# Altium schematic sheet Sensor Connection.SchDoc: Sensor Connection
size A4; DocumentNumber: 13; SheetNumber: 13; SheetTotal: 51
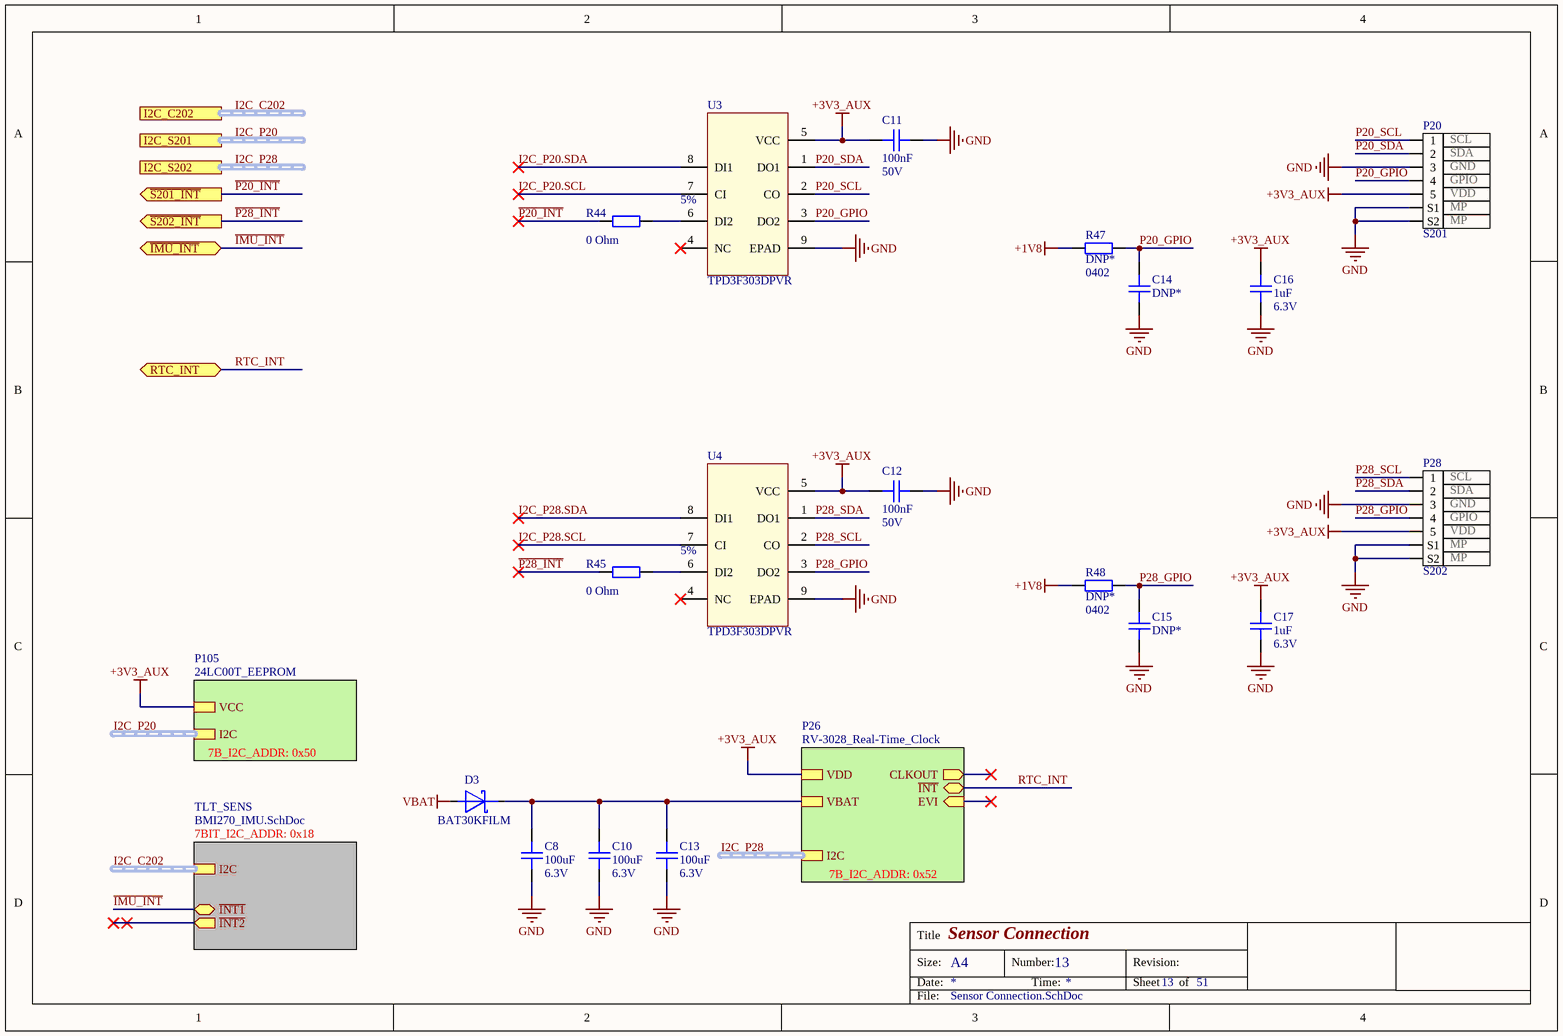
[diagram p0: Sensor Connection.SchDoc]

## Parts
C8  Capacitance: 100uF  Voltage Rating: 6.3V  [C0805]  (hidden comment: CAP CER 100UF 6.3V X5R 0805)
C10  Capacitance: 100uF  Voltage Rating: 6.3V  [C0805]  (hidden comment: CAP CER 100UF 6.3V X5R 0805)
C11  Capacitance: 100nF  Voltage: 50V  [C0402]  (hidden comment: CAP CER 0.1UF 50V X7R 0402)
C12  Capacitance: 100nF  Voltage: 50V  [C0402]  (hidden comment: CAP CER 0.1UF 50V X7R 0402)
C13  Capacitance: 100uF  Voltage Rating: 6.3V  [C0805]  (hidden comment: CAP CER 100UF 6.3V X5R 0805)
C14  DNP*  [C0402]  (no BOM)
C15  DNP*  [C0402]  (no BOM)
C16  Capacitance: 1uF  Voltage Rating: 6.3V  [C0402]  (hidden comment: CAP CER 1UF 6.3V X5R 0402)
C17  Capacitance: 1uF  Voltage Rating: 6.3V  [C0402]  (hidden comment: CAP CER 1UF 6.3V X5R 0402)
D3  BAT30KFILM  [SOD-523]
P20  S201  pin_1: SCL  pin_2: SDA  pin_3: GND  pin_4: GPIO  pin_5: VDD  pin_MP1: MP  [CONN_0545500571]
P28  S202  pin_1: SCL  pin_2: SDA  pin_3: GND  pin_4: GPIO  pin_5: VDD  pin_MP1: MP  [CONN_0545500571]
R44  Tolerance: 5%  Resistance: 0 Ohm  [R0402]  (hidden comment: RES SMD 0 OHM JUMPER 1/16W 0402)
R45  Tolerance: 5%  Resistance: 0 Ohm  [R0402]  (hidden comment: RES SMD 0 OHM JUMPER 1/16W 0402)
R47  DNP*  Case/Package: 0402  [R0402]  (no BOM)
R48  DNP*  Case/Package: 0402  [R0402]  (no BOM)
U3  TPD3F303DPVR  [DPV8_1P7X0P4]
U4  TPD3F303DPVR  [DPV8_1P7X0P4]

## Sub-sheets
P26 = RV-3028_Real-Time_Clock: I2C (harness I2C), EVI (in), CLKOUT (out), ~{INT} (bidir), VDD, VBAT  | 7B_I2C_ADDR: 0x52
P105 = 24LC00T_EEPROM: I2C (harness I2C), VCC  | 7B_I2C_ADDR: 0x50
TLT_SENS = BMI270_IMU.SchDoc: ~{INT2} (out), ~{INT1} (bidir), I2C (harness I2C)  | 7BIT_I2C_ADDR: 0x18

## Ports
I2C_C202 (harness I2C), I2C_S201 (harness I2C), I2C_S202 (harness I2C), RTC_INT (bidir), ~{IMU_INT} (bidir), ~{S201_INT} (out), ~{S202_INT} (out)

## Nets
+1V8: R47.2 R48.2
+3V3_AUX: C11.1 C12.1 C16.2 C17.2 P20.5 P28.5 U3.5(VCC) U4.5(VCC) ; sheet P105/VCC, sheet P26/VDD
GND: C8.1 C10.1 C11.2 C12.2 C13.1 C14.1 C15.1 C16.1 C17.1 P20.0(S1) P20.3 P28.0(S1) P28.3 U3.9(EPAD) U4.9(EPAD)
VBAT: D3.2(A)
~{IMU_INT}: port ~{IMU_INT}, sheet TLT_SENS/~{INT1}
~{P20_INT}: R44.1 ; port ~{S201_INT}
~{P28_INT}: R45.1 ; port ~{S202_INT}
I2C_P20.SCL: U3.7(CI)
I2C_P20.SDA: U3.8(DI1)
I2C_P28.SCL: U4.7(CI)
I2C_P28.SDA: U4.8(DI1)
P20_GPIO: C14.2 P20.4 R47.1 U3.3(DO2)
P20_SCL: P20.1 U3.2(CO)
P20_SDA: P20.2 U3.1(DO1)
P28_GPIO: C15.2 P28.4 R48.1 U4.3(DO2)
P28_SCL: P28.1 U4.2(CO)
P28_SDA: P28.2 U4.1(DO1)
RTC_INT: port RTC_INT, sheet P26/~{INT}
NetC8_2: C8.2 C10.2 C13.2 D3.1(K) ; sheet P26/VBAT
NetR44_2: R44.2 U3.6(DI2)
NetR45_2: R45.2 U4.6(DI2)

Not connected (* = marked no-connect by the designer): U3 4(NC)*; U4 4(NC)*

## Buses and harness runs
harness I2C_C202 = port I2C_C202
harness I2C_C202 = sheet TLT_SENS/I2C
harness I2C_P20 = port I2C_S201
harness I2C_P20 = sheet P105/I2C
harness I2C_P28 = port I2C_S202
harness I2C_P28 = sheet P26/I2C

## Notes on the sheet
- Title
- Size:
- Date:
- A4
- Number:
- Time:
- Revision:
- Sheet
- of
- File:

## Library data of the parts
C8 C10 C13 = CAP CER 100UF 6.3V X5R 0805: 100 µF ±20% 6.3V Ceramic Capacitor X5R 0805 (2012 Metric); Manufacturer: CAL-CHIP ELECTRONICS, INC.; Manufacturer Part Number: GMC21X5R107M6R3NT; Supplier 1: Digi-Key; Stock 1: 3990; Pricing 1: 1=0.49, 10=0.348, 50=0.2632, 100=0.2293, 500=0.1698, 1000=0.1444 (USD); Mount: Surface Mount; Case/Package: 0805; Weight: 0.000571oz; Case Code (Imperial): 0805; Case Code (Metric): 2012; Min Operating Temperature: -55°C; Max Operating Temperature: 85°C; Tolerance: 20%; Packaging: Tape and Reel; Voltage Rating (DC): 6.3V; Dielectric: X5R; Termination: SMD/SMT; Composition: Ceramic; Length: 2mm; Width: 1.25mm; Thickness: 0.071inch; Depth: 1.5mm; Radiation Hardening: No; Lead Free: Lead Free; Halogen Free: Halogen Free; ComponentLink1URL: https://www.digikey.com/en/products/detail/cal-chip-electronics-inc/GMC21X5R107M6R3NT/12140431; ComponentLink1Description: https://www.digikey.com/en/products/detail/cal-chip-electronics-inc/GMC21X5R107M6R3NT/12140431; Supplier Part Number 1: 2571-GMC21X5R107M6R3NTTR-ND
C11 C12 = CAP CER 0.1UF 50V X7R 0402: 0.1µF ±10% 50V Ceramic Capacitor X7R 0402 (1005 Metric); Manufacturer: TDK; Manufacturer Part Number: CGA2B3X7R1H104K050BB; Supplier 1: Digi-Key; Stock 1: 2925303; Pricing 1: 1=0.17, 10=0.118, 50=0.0668, 100=0.0553, 500=0.0388, 1000=0.0321, 2500=0.0299, 5000=0.0273 (USD); Mount: Surface Mount; Case/Package: 0402; Weight: 2.3E-05oz; Case Code (Metric): 1005; Case Code (Imperial): 0402; Min Operating Temperature: -55°C; Max Operating Temperature: 125°C; Voltage Rating: 50V; Tolerance: 10%; Packaging: Tape and Reel; Package Quantity: 1; Voltage Rating (DC): 50V; Dielectric: X7R; Termination: SMD/SMT; Composition: Ceramic; Length: 1mm; Height: 0.5mm; Width: 0.02inch; Thickness: 0.022inch; Depth: 0.5mm; Ratings: AEC-Q200; REACH SVHC: No SVHC; Lead Free: Lead Free; ComponentLink1URL: http://product.tdk.com/capacitor/mlcc/en/documents/mlccspec_automotive_general_midvoltage_en.pdf?src-supplier=Future+Electronics; ComponentLink1Description: http://product.tdk.com/capacitor/mlcc/en/documents/mlccspec_automotive_general_midvoltage_en.pdf?src-supplier=Future+Electronics; ComponentLink2URL: http://www.farnell.com/datasheets/1807242.pdf?src-supplier=Element14; ComponentLink2Description: http://www.farnell.com/datasheets/1807242.pdf?src-supplier=Element14; ComponentLink3URL: http://www.mouser.com/ds/2/400/lcc_automotive_general_en-843974.pdf?src-supplier=Mouser; ComponentLink3Description: http://www.mouser.com/ds/2/400/lcc_automotive_general_en-843974.pdf?src-supplier=Mouser; ComponentLink4URL: http://www.farnell.com/datasheets/1936565.pdf?src-supplier=Element14; ComponentLink4Description: http://www.farnell.com/datasheets/1936565.pdf?src-supplier=Element14; ComponentLink5URL: http://www.farnell.com/datasheets/1735392.pdf?src-supplier=Element14; ComponentLink5Description: http://www.farnell.com/datasheets/1735392.pdf?src-supplier=Element14; Supplier Part Number 1: 445-6899-1-ND
C14 C15 = CAP CER NO_BOM 0402: Placeholder for a 0402 capacitor
C16 C17 = CAP CER 1UF 6.3V X5R 0402: 1µF ±10% 6.3V Ceramic Capacitor X5R 0402 (1005 Metric); Manufacturer: Yageo; Manufacturer Part Number: CC0402KRX5R5BB105; Supplier 1: Digi-Key; Stock 1: 34926286; Pricing 1: 1=0.1, 10=0.05, 50=0.0272, 100=0.0222, 500=0.0158, 1000=0.0124, 2500=0.0113, 5000=0.0104 (USD); Mount: Surface Mount; Number of Pins: 2; Case Code (Imperial): 0402; Case Code (Metric): 1005; Min Operating Temperature: -55°C; Max Operating Temperature: 85°C; Tolerance: 10%; Packaging: Tape and Reel; Termination: SMD/SMT; Voltage Rating (DC): 6.3V; Composition: Ceramic; Length: 1mm; Height: 0.5mm; Width: 0.02inch; Thickness: 0.022inch; Depth: 0.5mm; Radiation Hardening: No; Lead Free: Lead Free; Halogen Free: Halogen Free; ComponentLink1URL: http://www.farnell.com/datasheets/70765.pdf?src-supplier=Farnell; ComponentLink1Description: http://www.farnell.com/datasheets/70765.pdf?src-supplier=Farnell; Supplier Part Number 1: 311-1438-1-ND; Dielectric: X5R; Case/Package: 0402; Dielectric Material: Ceramic; Package Quantity: 1; REACH SVHC: No SVHC; ComponentLink2URL: http://www.yageo.com/documents/recent/UPY-GPHC_X5R_4V-to-50V_25.pdf?src-supplier=Digi-Key; ComponentLink2Description: http://www.yageo.com/documents/recent/UPY-GPHC_X5R_4V-to-50V_25.pdf?src-supplier=Digi-Key; ComponentLink3URL: http://www.farnell.com/datasheets/2167237.pdf?src-supplier=Element14; ComponentLink3Description: http://www.farnell.com/datasheets/2167237.pdf?src-supplier=Element14; ComponentLink4URL: http://www.yageo.com/documents/recent/UPY-GPHC_X5R_4V-to-50V_12.pdf?src-supplier=Avnet+Europe; ComponentLink4Description: http://www.yageo.com/documents/recent/UPY-GPHC_X5R_4V-to-50V_12.pdf?src-supplier=Avnet+Europe; ComponentLink5URL: http://www.farnell.com/datasheets/1359354.pdf?src-supplier=Element14; ComponentLink5Description: http://www.farnell.com/datasheets/1359354.pdf?src-supplier=Element14; ComponentLink6URL: http://www.farnell.com/datasheets/70765.pdf?src-supplier=Element14; ComponentLink6Description: http://www.farnell.com/datasheets/70765.pdf?src-supplier=Element14; ComponentLink7URL: http://www.yageo.com/documents/recent/UPY-GPHC_X5R_4V-to-50V_12.pdf?src-supplier=Avnet; ComponentLink7Description: http://www.yageo.com/documents/recent/UPY-GPHC_X5R_4V-to-50V_12.pdf?src-supplier=Avnet
D3 = DIODE SCHOTTKY 30V 300MA SOD523: Diode Schottky 30 V 300mA (DC) Surface Mount SOD-523; Manufacturer: STMicroelectronics; Forward Voltage: 530mV; Max Power Dissipation: 100mW; Max Repetitive Reverse Voltage (Vrrm): 30V; Element Configuration: Single; Supplier 1: Digi-Key; Manufacturer Part Number: BAT30KFILM; Stock 1: 28802; Case/Package: SOD-523; Number of Pins: 2; Contact Plating: Tin,Matte; Min Operating Temperature: -55°C; Max Operating Temperature: 125°C; Forward Current: 300mA; Package Quantity: 1; Packaging: Tape and Reel; Average Rectified Current: 300mA; Power Dissipation: 100mW; Termination: SMD/SMT; Max Reverse Voltage (DC): 30V; Lead Free: Lead Free; ComponentLink1URL: https://www.digikey.com/en/products/detail/stmicroelectronics/BAT30KFILM/1207019?s=N4IgTCBcDaIEIEEAqBmADAaQGIEkAyAsiALoC%2BQA; ComponentLink1Description: https://www.digikey.com/en/products/detail/stmicroelectronics/BAT30KFILM/1207019?s=N4IgTCBcDaIEIEEAqBmADAaQGIEkAyAsiALoC%2BQA; Supplier Part Number 1: 497-5552-1-ND; Mount: Surface Mount
P20 P28 = CONN FFC FPC TOP 5POS 0.50MM R/A: 5 Position FFC, FPC Connector Contacts, Top 0.020" (0.50mm) Surface Mount, Right Angle; Manufacturer: Molex; Manufacturer Part Number: 0545500571; Actuator Material: Polyphenylene; Current Rating: 500mA; Voltage Rating: 50V; Number of Positions: 5; Contact Resistance: 40mR; Wire/Cable Type: Straight; Pitch: 0.02inch; Supplier 1: Digi-Key; Stock 1: 20865; Pricing 1: 1=0.98, 10=0.808, 100=0.673, 1000=0.5384 (USD); Mount: Surface Mount; Contact Material: Bronze; Contact Plating: Gold; Housing Material: Polymer; Min Operating Temperature: -20°C; Max Operating Temperature: 85°C; Package Quantity: 1; Packaging: Tape and Reel; Number of Rows: 1; Termination: Solder; Orientation: Right Angle; Length: 7.7mm; Depth: 5mm; Radiation Hardening: No; Flammability Rating: UL94 V-0; ComponentLink1URL: http://www.molex.com/webdocs/datasheets/pdf/en-us/0545500571_FFC_FPC_CONNECTORS.pdf?src-supplier=Avnet; ComponentLink1Description: http://www.molex.com/webdocs/datasheets/pdf/en-us/0545500571_FFC_FPC_CONNECTORS.pdf?src-supplier=Avnet; Supplier Part Number 1: WM8824CT-ND; pin_MP2: MP
R44 R45 = RES SMD 0 OHM JUMPER 1/16W 0402: 0 Ohms Jumper 0.063W, 1/16W Chip Resistor 0402 (1005 Metric) Moisture Resistant Thick Film; Manufacturer: Yageo; Manufacturer Part Number: RC0402JR-070RL; Power Rating: 62.5mW; Voltage Rating: 50V; Max Power Dissipation: 63mW; Temperature Coefficient: 200ppm/°C; Supplier 1: Digi-Key; Stock 1: 46057148; Pricing 1: 1=0.1, 10=0.013, 25=0.0092, 50=0.0072, 100=0.0053, 250=0.004, 500=0.0032, 1000=0.0024, 5000=0.0017 (USD); Contact Plating: Tin,Matte; Case Code (Metric): 1005; Case Code (Imperial): 0402; Min Operating Temperature: -55°C; Max Operating Temperature: 155°C; Packaging: Tape and Reel; Composition: Thick Film; Package Quantity: 1; Number of Terminations: 2; Termination: SMD/SMT; Military Standard: Not; Features: Moisture Resistant; Length: 1mm; Height: 0.016inch; Width: 0.02inch; Depth: 0.5mm; Radiation Hardening: No; REACH SVHC: Unknown; Lead Free: Lead Free; ComponentLink1URL: http://www.yageo.com/documents/recent/PYu-RC_Group_51_RoHS_L_10.pdf?src-supplier=Digi-Key; ComponentLink1Description: http://www.yageo.com/documents/recent/PYu-RC_Group_51_RoHS_L_10.pdf?src-supplier=Digi-Key; ComponentLink2URL: http://www.yageo.com/documents/recent/PYu-RC0402_51_RoHS_L_6.pdf?src-supplier=Avnet+Europe; ComponentLink2Description: http://www.yageo.com/documents/recent/PYu-RC0402_51_RoHS_L_6.pdf?src-supplier=Avnet+Europe; ComponentLink3URL: http://www.farnell.com/datasheets/1018594.pdf?src-supplier=Element14; ComponentLink3Description: http://www.farnell.com/datasheets/1018594.pdf?src-supplier=Element14; ComponentLink4URL: https://www.verical.com/server-webapp/html/getDatasheet?partID=326379&src-supplier=Verical; ComponentLink4Description: https://www.verical.com/server-webapp/html/getDatasheet?partID=326379&src-supplier=Verical; ComponentLink5URL: http://www.farnell.com/datasheets/2167052.pdf?src-supplier=Element14; ComponentLink5Description: http://www.farnell.com/datasheets/2167052.pdf?src-supplier=Element14; Supplier Part Number 1: 311-0.0JRCT-ND; Case/Package: 0402; Mount: Surface Mount
R47 R48 = RES SMD NO BOM 0402: Placeholder for a 0402 resistor
U3 U4 = FILTER RC(PI) ESD SMD  8-UFDFN EP: RC (Pi) EMI Filter 2nd Order Low Pass 3 Channel R = 47Ohms, 100Ohms, C = 20pF  8-UFDFN Exposed Pad; Manufacturer: Texas Instruments; Number of Channels: 3; Operating Supply Voltage: 5.5V; ESD Protection: Yes; Clamping Voltage: 10V; Frequency: 308MHz; Supplier 1: Digi-Key; Manufacturer Part Number: TPD3F303DPVR; Stock 1: 4896; Pricing 1: 1=0.85, 10=0.812, 25=0.7856, 50=0.6414, 100=0.576, 250=0.5236, 500=0.4974, 1000=0.4451 (USD); Case/Package: SMD/SMT; Number of Pins: 8; Contact Plating: Gold; Min Operating Temperature: -40°C; Max Operating Temperature: 85°C; Package Quantity: 1; Packaging: Tape and Reel; Capacitance: 20pF; Termination: Flat; Length: 2.2mm; Height: 0.026inch; Width: 0.063inch; Depth: 1.7mm; Radiation Hardening: No; REACH SVHC: No SVHC; Lead Free: Lead Free; ComponentLink1URL: http://www.ti.com/lit/ds/symlink/tpd3f303.pdf?src-supplier=Digi-Key; ComponentLink1Description: http://www.ti.com/lit/ds/symlink/tpd3f303.pdf?src-supplier=Digi-Key; ComponentLink2URL: http://focus.ti.com/lit/ds/symlink/tpd3f303.pdf?src-supplier=Avnet+Europe; ComponentLink2Description: http://focus.ti.com/lit/ds/symlink/tpd3f303.pdf?src-supplier=Avnet+Europe; ComponentLink3URL: https://www.verical.com/server-webapp/html/getDatasheet?partID=302817&src-supplier=Verical; ComponentLink3Description: https://www.verical.com/server-webapp/html/getDatasheet?partID=302817&src-supplier=Verical; ComponentLink4URL: http://www.farnell.com/datasheets/1558442.pdf?src-supplier=Element14; ComponentLink4Description: http://www.farnell.com/datasheets/1558442.pdf?src-supplier=Element14; Supplier Part Number 1: 296-28299-1-ND; Mount: Surface Mount